# EAGLE design StorageBat_PSU (EAGLE 5.10)
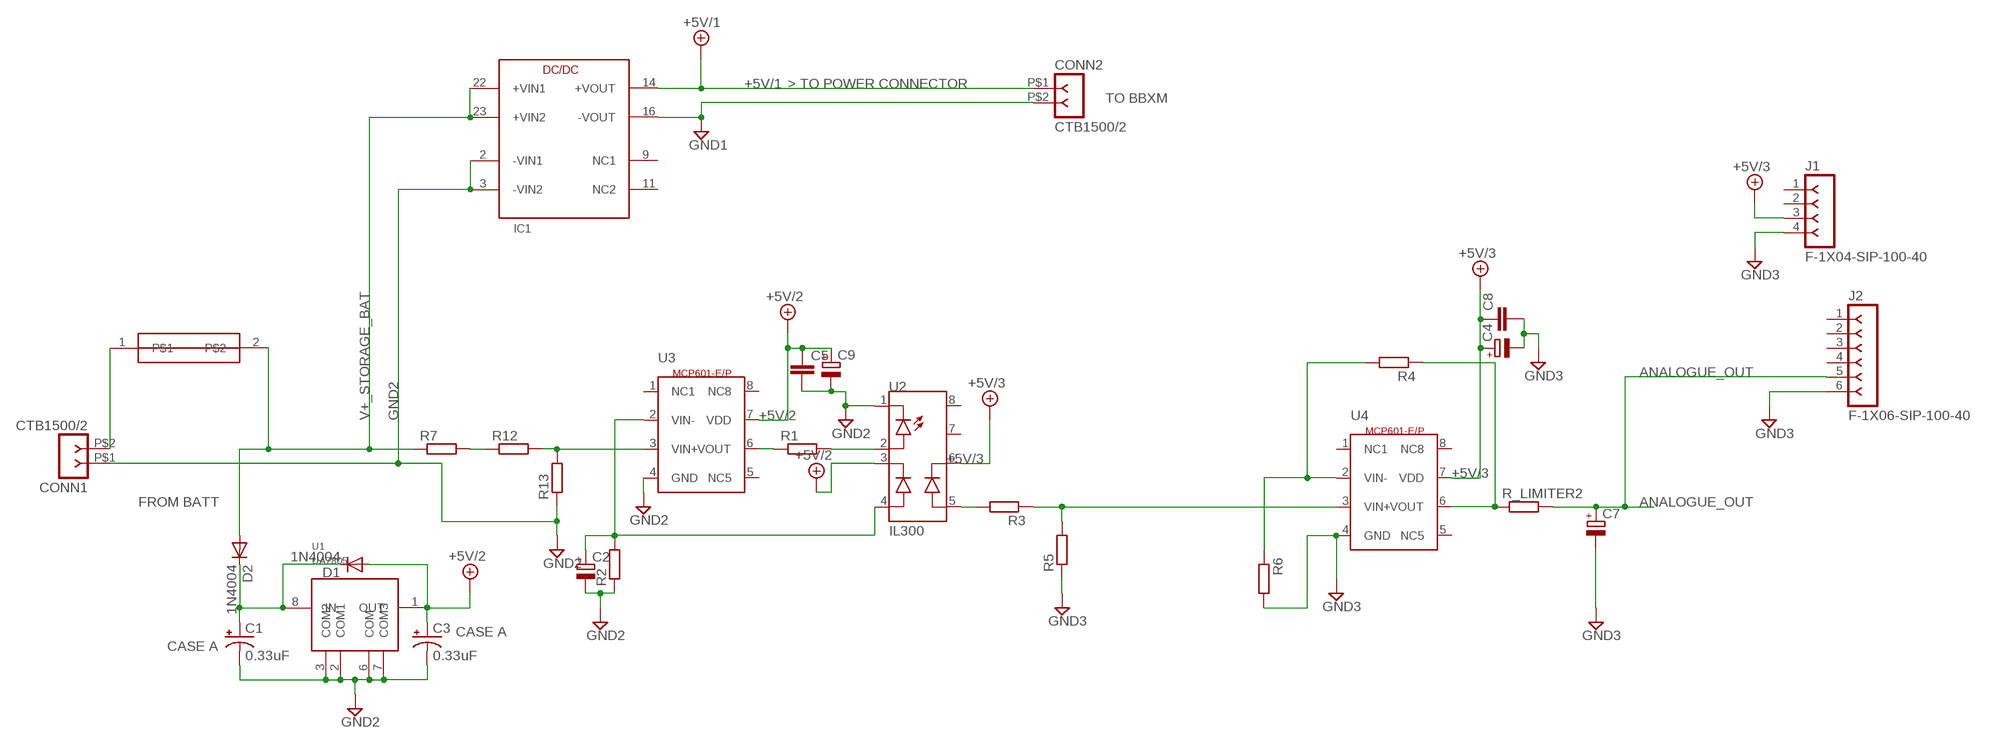
[diagram p0: schematic, sheet 1]

## Parts
C1  0.33uF  CPOL-USA/3216-18W  [A/3216-18W]
C2  CPOL1  [E2,5-7---100UF]
C3  0.33uF  CPOL-USA/3216-18W  [A/3216-18W]
C4  CPOL1  [E2,5-7---100UF]
C5  C-EUC0603  [C0603]
C7  CPOL1  [E2,5-7---100UF]
C8  C-EUC0603  [C0603]
C9  CPOL1  [E2,5-7---100UF]
CONN1  CTB1500/2  [CTB1500-2]
CONN2  CTB1500/2  [CTB1500-2]
CONN3  MINIBLADE_SOCKET  [LTF153008]
D1  1N4004  [DO41-10]
D2  1N4004  [DO41-10]
IC1  TEL_5_SERIES  [TEL_5_SERIES]
J1  F-1X04-SIP-100-40  [SIP-100-04-40]
J2  F-1X06-SIP-100-40  [SIP-100-06-40]
R1  R  [0207/10]
R2  R  [0207/10]
R3  R  [0207/10]
R4  R  [0207/10]
R5  R  [0207/10]
R6  R  [0207/10]
R7  R  [0207/10]
R12  R  [0207/10]
R13  R  [0207/10]
R_LIMITER2  R  [0207/10]
U1  UA7805  [R_PDSO_G8]
U2  IL300  [SO8]
U3  MCP601  [SO8]
U4  MCP601  [SO8]

## Nets
+5V/1: CONN2.P$1 IC1.14(+VOUT)
+5V/2: C3.+ C5.1 C9.+ D1.A U1.1(OUT) U2.3(C_FB) U3.7(VDD)
+5V/3: C4.+ C8.1 J1.3 U2.6(C_OUT) U4.7(VDD)
ANALOGUE_OUT: C7.+ J2.5 R_LIMITER2.2
GND1: CONN2.P$2 IC1.16(-VOUT)
GND2: C1.- C2.- C3.- C5.2 C9.- CONN1.P$1 IC1.2(-VIN1) IC1.3(-VIN2) R2.1 R13.1 U1.2(COM1) U1.3(COM2) U1.6(COM) U1.7(COM3) U2.1(C_LED) U3.4(GND)
GND3: C4.- C7.- C8.2 J1.4 J2.6 R5.1 R6.2 U4.4(GND)
N$1: R1.2 U2.2(A_LED)
N$2: R1.1 U3.6(VOUT)
N$3: C2.+ R2.2 U2.4(A_FB) U3.2(VIN-)
N$4: R7.2 R12.1
N$5: CONN1.P$2 CONN3.1
N$6: R4.1 R_LIMITER2.1 U4.6(VOUT)
N$7: R3.2 U2.5(A_OUT)
N$8: R4.2 R6.1 U4.2(VIN-)
N$9: C1.+ D1.C D2.C U1.8(IN)
N$12: R12.2 R13.2 U3.3(VIN+)
U4: R3.1 R5.2 U4.3(VIN+)
V+_STORAGE_BAT: CONN3.2 D2.A IC1.22(+VIN1) IC1.23(+VIN2) R7.1
Unconnected: IC1.9(NC1) IC1.11(NC2) J1.1 J1.2 J2.1 J2.2 J2.3 J2.4 U2.7(PIN7) U2.8(PIN8) U3.1(NC1) U3.5(NC5) U3.8(NC8) U4.1(NC1) U4.5(NC5) U4.8(NC8)

## Notes on the sheet
- > TO POWER CONNECTOR
- TO BBXM
- FROM BATT
- CASE A
- CASE A

## Library data of the parts
C1 C3 = resistor:CPOL-US: POLARIZED CAPACITOR, American symbol
C2 C4 C7 C9 = ee2parts:CPOL: Electrolytic (polarised) capacitor
C5 C8 = resistor:C-EU: CAPACITOR, European symbol
CONN1 CONN2 = eko-parts:CTB1500/2
CONN3 = eko-parts:MINIBLADE_SOCKET
D1 D2 = diode:1N4004: DIODE general purpose rectifier, 1 A
IC1 = traco_thl_tel_series:TEL_5_SERIES: TRACO POWER DC/DC converter TEL 5 Series created by Mario Blunk - electronics & IT engineering at www.train-z.de
J1 = con-headers-jp:F-1X04-: FEMALE HEADER
J2 = con-headers-jp:F-1X06-: FEMALE HEADER
R1-R7 R12 R13 R_LIMITER2 = ee2parts:R: Resistor
U1 = eko-parts:UA7805
U2 = eko-parts:IL300
U3 U4 = eko-parts:MCP601

## Board
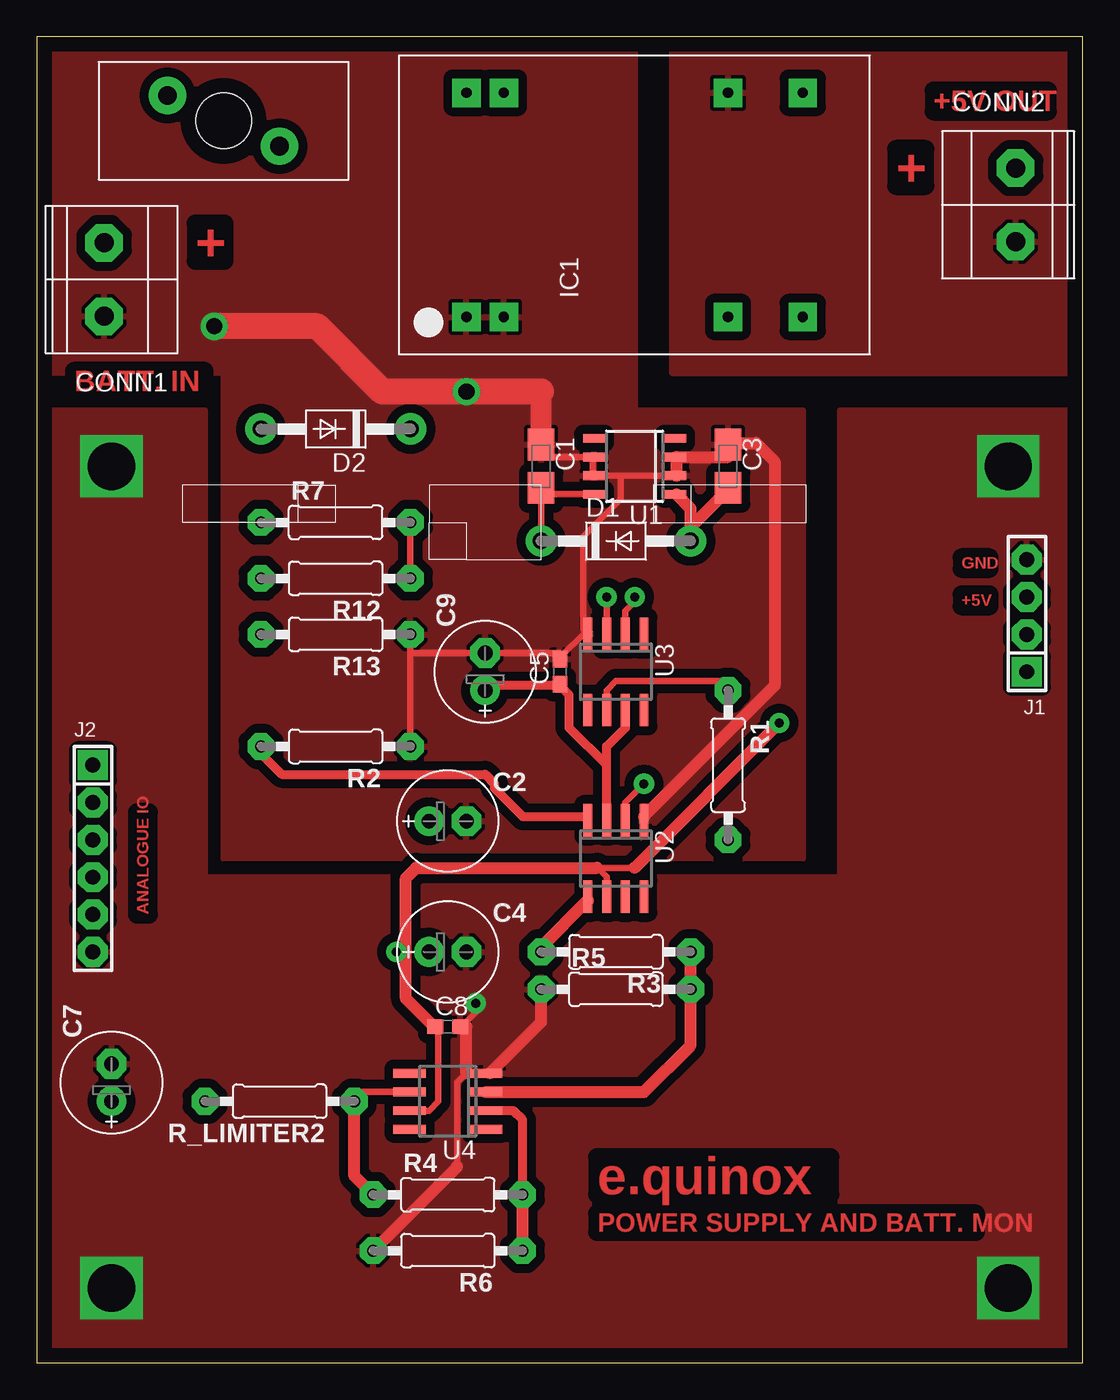
[diagram p1: board, top side]
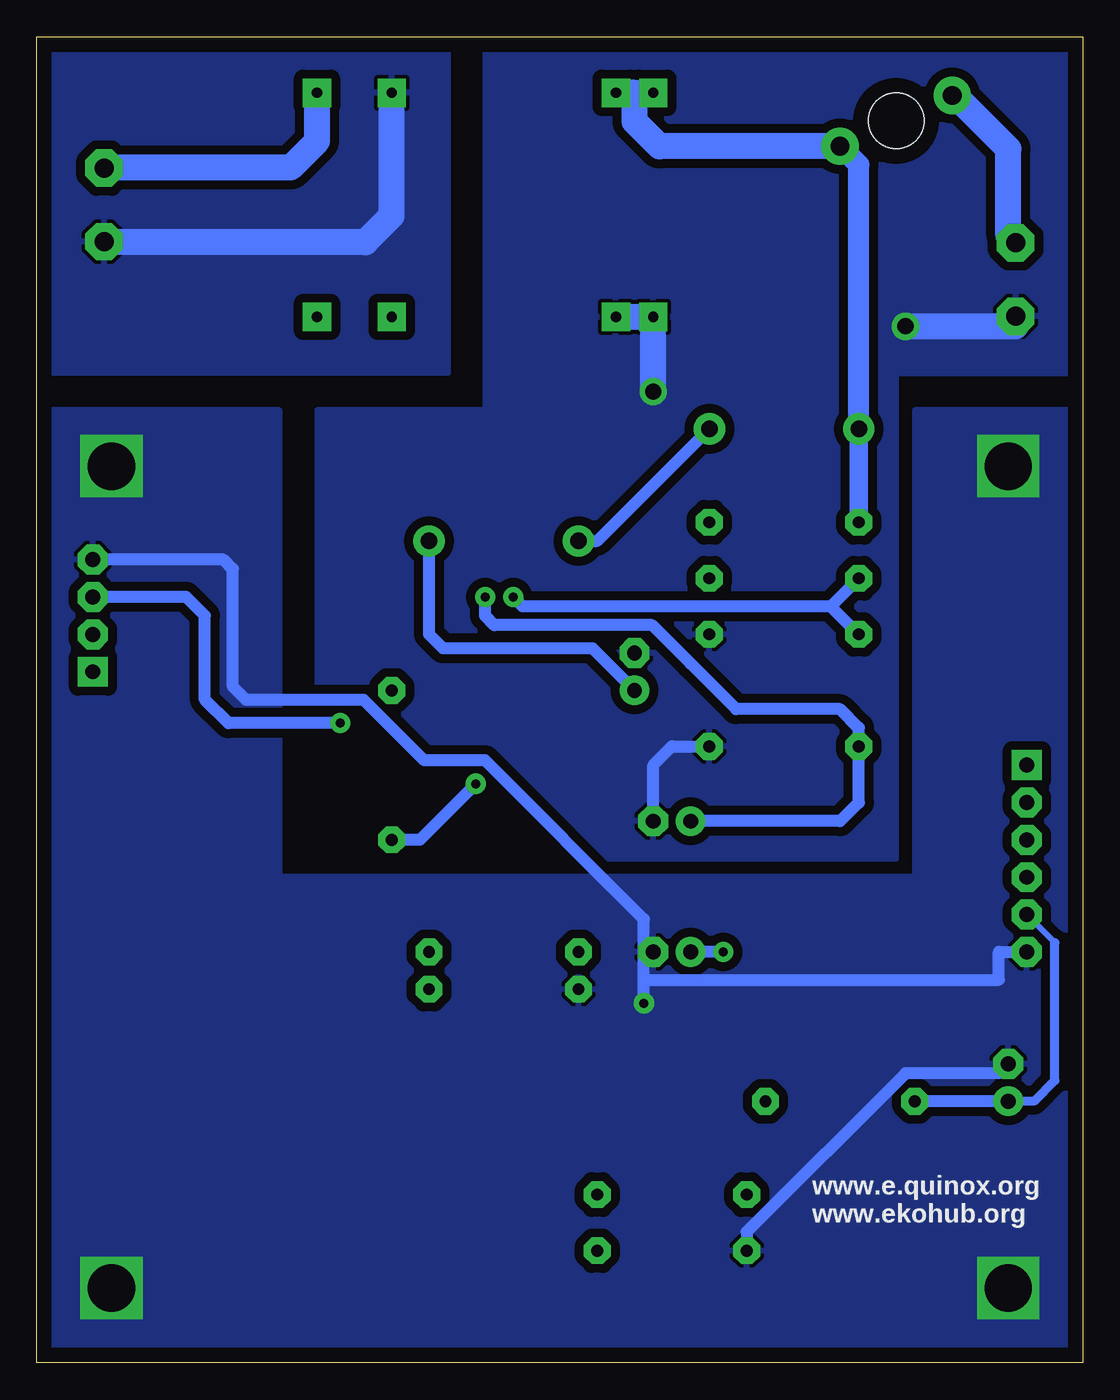
[diagram p2: board, bottom side, seen from below]

Size 71.12 x 90.17 mm. Coordinates in mm from the lower left corner, seen from the top.
Outline: 0,0 71.12,0 71.12,90.17 0,90.17 0,0
Copper layers (1*16): Top 0.035mm / dielectric 1.5mm / Bottom 0.035mm
Design rules "default *": minimum track width 15mil, minimum drill 24mil, track to track 15mil, track to pad 15mil, pad to pad 15mil, via to via 15mil, smd to smd 8mil, copper to edge 40mil, drill to drill 8mil, minimum pad ring 20mil, minimum via ring 15mil, stop-mask expansion 4mil, vias tented up to drill 0mil, thermal gap 10mil

### Footprints (pad centres in the part's own frame; a part is rotated, then mirrored left to right if it is on the bottom)
A/3216-18W = smd 2.15 x 1.8: + 1.475,0; - -1.475,0
E2,5-7---100UF = drill 1 pad 1.6 round: + -1.27,0 | drill 1 pad 1.6 octagon: - 1.27,0
C0603 = smd 1.1 x 1: 1 -0.85,0; 2 0.85,0
CTB1500-2 = drill 1.3 pad 2.54 octagon: P$1 -2.5,0.5; P$2 2.5,0.5
LTF153008 = drill 1.27 pad 2.54 round: 1 1.73,3.81; 2 -1.73,-3.81 | hole 3.78: 0,0
DO41-10 = drill 1.118 round: A 5.08,0; C -5.08,0
TEL_5_SERIES = drill 0.7 pad 1.93 square: 2 -11.43,-7.62; 3 -8.89,-7.62; 9 6.35,-7.62; 11 11.43,-7.62; 14 11.43,7.62; 16 6.35,7.62; 22 -8.89,7.62; 23 -11.43,7.62
SIP-100-04-40 = drill 1.016 pad 1.778 square: 1 -3.81,0 | drill 1.016 pad 1.778 octagon: 2 -1.27,0; 3 1.27,0; 4 3.81,0
SIP-100-06-40 = drill 1.016 pad 1.778 square: 1 -6.35,0 | drill 1.016 pad 1.778 octagon: 2 -3.81,0; 3 -1.27,0; 4 1.27,0; 5 3.81,0; 6 6.35,0
0207/10 = drill 0.8 octagon: 1 -5.08,0; 2 5.08,0
R_PDSO_G8 = smd 0.6 x 1.5: 1 -1.905,-2.75; 2 -0.635,-2.75; 3 0.635,-2.75; 4 1.905,-2.75; 5 1.905,2.75; 6 0.635,2.75; 7 -0.635,2.75; 8 -1.905,2.75
SO8 = smd 0.6 x 2.2: 1 -1.905,-2.6; 2 -0.635,-2.6; 3 0.635,-2.6; 4 1.905,-2.6; 5 1.905,2.6; 6 0.635,2.6; 7 -0.635,2.6; 8 -1.905,2.6

### Placement (x,y rotation side)
C1  34.29,60.96 270 top
C2  27.94,36.83 0 top
C3  46.99,60.96 270 top
C4  27.94,27.94 0 top
C5  35.56,46.99 90 top
C7  5.08,19.05 90 top
C8  27.94,22.86 0 top
C9  30.48,46.99 90 top
CONN1  5.08,73.66 90 top
CONN2  66.04,78.74 270 top
CONN3  12.7,84.45 90 top
D1  39.37,55.88 0 top
D2  20.32,63.5 180 top
IC1  40.64,78.74 0 top
J1  67.31,50.8 90 top
J2  3.81,34.29 270 top
R1  46.99,40.64 270 top
R2  20.32,41.91 180 top
R3  39.37,27.94 180 top
R4  27.94,11.43 0 top
R5  39.37,25.4 0 top
R6  27.94,7.62 180 top
R7  20.32,57.15 0 top
R12  20.32,53.34 180 top
R13  20.32,49.53 180 top
R_LIMITER2  16.51,17.78 180 top
U1  40.64,60.96 90 top
U2  39.37,34.29 180 top
U3  39.37,46.99 180 top
U4  27.94,17.78 90 top

### Tracks (layer width: path | path; a pad name or v marks a point on that pad's centre or on a via)
+5V/1
  Bottom 0.457: 66.36,81.28 CONN2.P$1
  Bottom 1.778: 66.36,81.28 53.87,81.28 52.07,83.08 IC1.14
+5V/2
  Top 0.457: 43.5,59.05 U1.1 | 46.99,59.37 C3.+ | D1.A 44.45,56.83 | 30.48,46.04 C9.+ | 40.01,43.18 U3.7 | 35.56,46.04 C5.1
  Top 0.61: 30.48,46.04 35.56,46.04 36.2,45.4 36.2,43.18 38.73,40.64 | 38.73,40.64 38.73,41.91 40.01,43.18 | U2.3 38.73,40.64
  Top 0.813: 43.5,59.05 44.45,58.1 44.45,56.83 46.99,59.37
  Bottom 0.813: D1.A 44.45,49.53 43.5,48.58 33.34,48.58 C9.+
+5V/3  (via drill 0.61)
  Top 0.457: U4.7 26.67,17.14 27.3,17.78 27.3,22.86 C8.1 26.99,22.86 | 38.1,33.66 38.26,33.5 | 38.26,33.5 38.73,33.02 U2.6 | 25.08,27.94 v24.45,27.94 | 40.64,33.66 38.42,33.66 38.26,33.5
  Top 0.813: 38.1,33.66 25.79,33.66 25.08,32.95 25.08,27.94 25.08,24.77 26.99,22.86 | 40.64,33.66 v50.48,43.5
  Bottom 0.813: v24.45,27.94 C4.+ | J1.3 60.96,52.07 59.69,50.8 59.69,45.09 58.1,43.5 v50.48,43.5
ANALOGUE_OUT
  Bottom 0.457: 1.91,28.57 J2.5
  Bottom 0.61: 1.91,28.57 1.91,19.2 3.33,17.78 C7.+
  Bottom 0.813: C7.+ R_LIMITER2.2
GND1
  Bottom 0.457: CONN2.P$2 66.36,76.52
  Bottom 1.422: 66.54,76.2 CONN2.P$2
  Bottom 1.778: IC1.16 46.99,78 48.79,76.2 66.54,76.2
  pour Bottom (isolate 0.61): 43.18,90.17 43.18,67.31 71.12,67.31 71.12,90.17
  pour Top (isolate 0.61): 43.18,90.17 43.18,67.31 71.12,67.31 71.12,90.17
GND2  (via drill 1.1)
  Top 0.457: 37.31,49.69 37.47,49.85 U3.4 | 37.31,49.69 35.56,47.94 C5.2 35.56,48.26 C9.- 25.4,48.26 | 25.4,48.26 R13.1 | R2.1 25.4,48.26 | 37.78,61.59 37.78,60.33 U1.7 39.69,60.33 | 37.78,61.59 34.29,61.59 C1.- | 37.78,61.59 U1.6 | 43.5,60.33 U1.2 39.69,60.33 | 43.5,61.59 U1.3 | 46.99,61.59 C3.- | 41.27,37.15 U2.1 | 39.69,60.33 39.69,58.74 37.15,56.2 37.15,49.85 37.31,49.69
  Top 0.813: 43.5,60.33 43.5,61.59 46.99,61.59 | 41.27,37.15 50.16,46.04 50.16,61.28 48.9,62.55 46.99,62.55 C3.-
  Top 1.422: C1.- 34.29,66.04
  Top 1.778: v12.06,70.48 19.05,70.48 23.5,66.04 v29.21,66.04 34.29,66.04
  Bottom 0.813: C2.- 29.21,40.64 27.94,41.91 R2.1
  Bottom 1.422: CONN1.P$1 5.08,70.66
  Bottom 1.778: IC1.3 IC1.2 v29.21,66.04 | v12.06,70.48 4.58,70.48 CONN1.P$1
  pour Bottom (isolate 0.61): 40.64,90.17 40.64,64.77 52.07,64.77 52.07,34.29 12.7,34.29 12.7,67.31 0,67.31 0,90.17
  pour Top (isolate 0.61): 0,90.17 40.64,90.17 40.64,64.77 52.07,64.77 52.07,34.29 12.7,34.29 12.7,67.31 0,67.31
GND3  (via drill 0.61, 3.2 pad 0.41)
  Top 0.457: 30.8,19.68 U4.4 29.21,19.68 28.57,19.05 28.57,13.34 | v29.84,24.45 29.84,23.81 28.89,22.86 C8.2
  Top 0.813: 30.8,19.68 34.29,23.18 R5.1 | R6.2 28.57,13.34 | 28.89,22.86 29.21,22.86 29.21,19.68
  Bottom 0.813: C7.- 5.71,19.68 12.06,19.68 22.86,8.89 R6.2 | 29.84,26.04 29.84,27.94 | v29.84,24.45 29.84,26.04 | 29.84,26.04 5.71,26.04 5.71,27.94 J2.6 | 29.84,27.94 29.84,30.16 40.64,40.96 44.77,40.96 48.9,45.09 56.89,45.09 57.78,45.98 57.78,53.98 58.42,54.61 J1.4 | 29.84,27.94 C4.-
  other vias: 5.08,5.08 5.08,60.96 66.04,60.96 66.04,5.08
  pour Bottom (isolate 0.61): 0,64.77 11.43,64.77 11.43,33.02 54.61,33.02 54.61,64.77 71.12,64.77 71.12,0 0,0
  pour Top (isolate 0.61): 54.61,64.77 71.12,64.77 71.12,0 0,0 0,64.77 11.43,64.77 11.43,33.02 54.61,33.02
N$1  (via drill 0.61)
  Top 0.457: v41.27,39.37 40.01,38.1 U2.2
  Bottom 0.813: v41.27,39.37 45.09,35.56 R1.2
N$2
  Top 0.457: R1.1 46.99,46.35 39.37,46.35 38.73,45.72 U3.6
N$3  (via drill 0.61)
  Top 0.457: 37.47,37.15 U2.4 | v40.64,52.07 40.64,51.75 40.01,51.12 U3.2
  Top 0.61: 37.47,37.15 33.05,37.15 31.11,39.08 31.11,39.37 30.48,40.01 16.66,40.01 15.24,41.42 R2.2
  Bottom 0.813: v40.64,52.07 40.64,50.8 40.01,50.16 29.29,50.16 26.67,47.55 23.57,44.45 16.51,44.45 15.24,43.18 R2.2 15.24,38.1 16.51,36.83 C2.+
N$4
  Top 0.457: R12.1 R7.2
N$5
  Bottom 1.422: 8.89,86.36 CONN3.1
  Bottom 1.778: CONN1.P$2 5.08,76.66 5.08,82.55 8.89,86.36
N$6
  Top 0.457: R_LIMITER2.1 21.59,18.41 U4.6
  Top 0.813: R4.1 21.59,12.7 R_LIMITER2.1
N$7
  Top 0.457: R3.2 34.29,28.26 | 37.47,31.43 U2.5
  Top 0.813: 34.29,28.26 37.47,31.43
N$8
  Top 0.61: R4.2 33.02,16.51 32.38,17.14 U4.2
  Top 0.813: R6.1 R4.2
N$9
  Top 0.457: 34.29,59.05 U1.8 | 34.29,59.05 C1.+ 34.29,59.37 | D1.C 34.29,59.05
  Bottom 0.813: D2.C 33.02,55.88 D1.C
N$12  (via drill 0.61)
  Top 0.457: v38.73,52.07 U3.3
  Bottom 0.813: v38.73,52.07 38.1,51.44 17.14,51.44 | R13.2 17.14,51.44 | 17.14,51.44 R12.2
U4
  Top 0.813: U4.3 41.27,18.41 44.45,21.59 R5.2 R3.1
V+_STORAGE_BAT
  Bottom 1.27: R7.1 D2.A
  Bottom 1.422: D2.A 15.24,81.45 CONN3.2
  Bottom 1.778: CONN3.2 28.8,82.72 30.48,84.4 30.48,86.36 | 30.48,86.36 IC1.23 | 30.48,86.36 IC1.22

### Text on the board
Top: +5V OUT | + | + | BATT. IN | GND | +5V | ANALOGUE IO | e.quinox | POWER SUPPLY AND BATT. MON
bPlace: www.e.quinox.org | www.ekohub.org